# Altium schematic sheet 33_USB_VoCore.SchDoc
size A; SheetNumber: 7; SheetTotal: 11
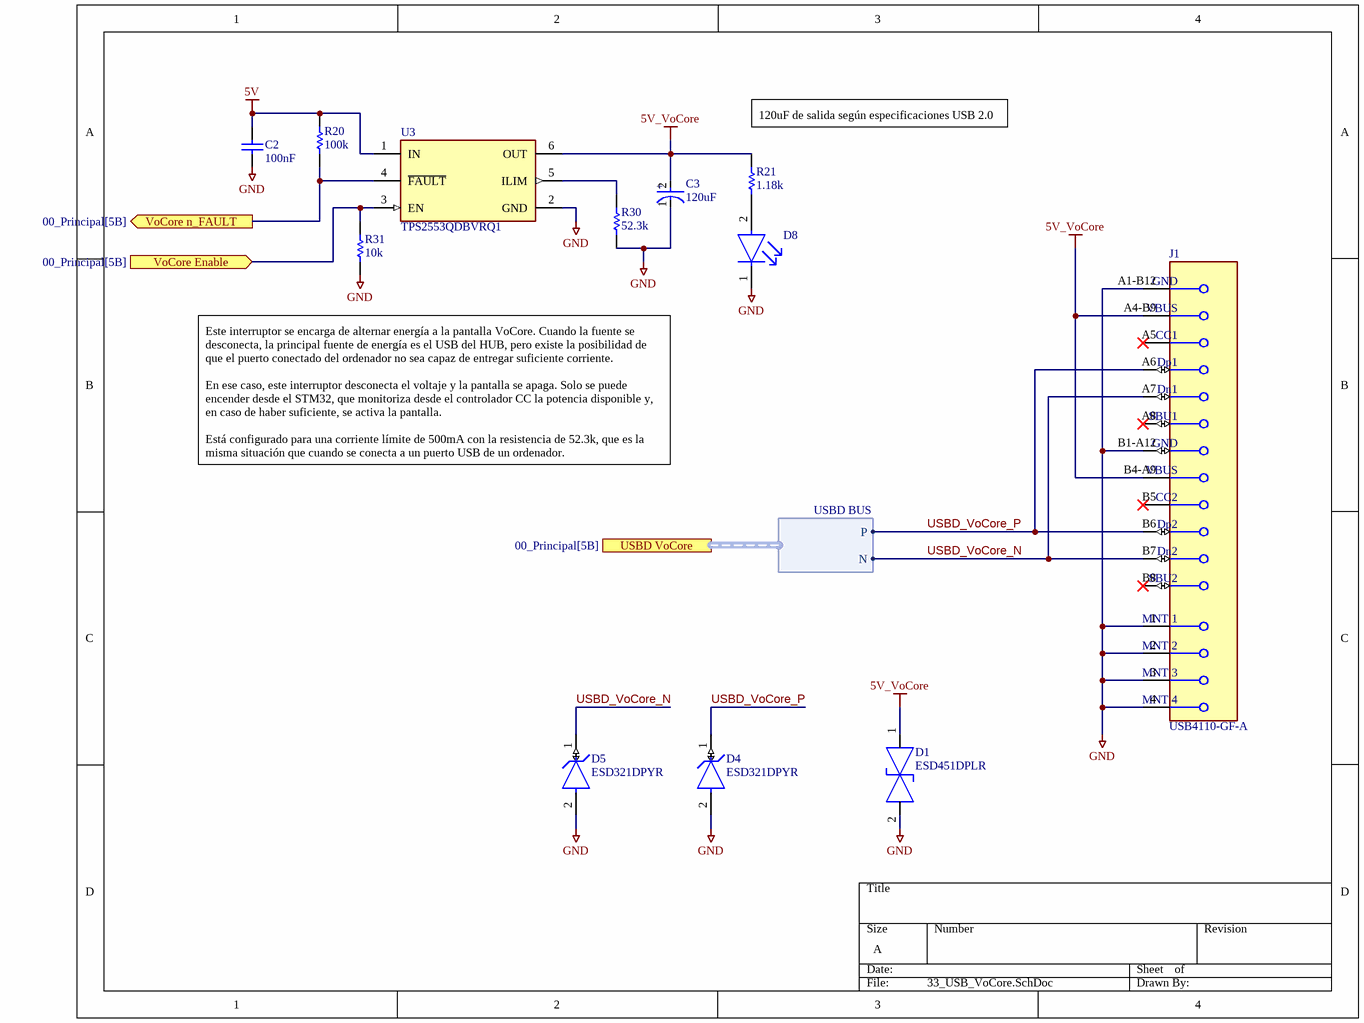
[diagram p0: 33_USB_VoCore.SchDoc]

## Parts
C2  100nF  [CAPC1005X55X25NL05T05]
C3  120uF  [FP-OS-CON-SMT-E7-MFG]
D1  ESD451DPLR  [FP-DPL0002A_MFG]
D4  ESD321DPYR  [FP-DPY0002A-MFG]
D5  ESD321DPYR  [FP-DPY0002A-MFG]
D8  APHD1608LZGCK  [FP-APHD1608LZGCK-MFG]  (value not drawn)
J1  USB4110-GF-A  [FP-USB4110-GF-A-MFG]
R20  100k  [RESC1005X40X25LL05T05]
R21  1.18k  [RESC1005X40X25NL05T05]
R30  52.3k  [RESC1005X40X25LL05T05]
R31  10k  [RESC1005X40X25ML05T05]
U3  TPS2553QDBVRQ1  [FP-DBV0006A-IPC_A]

## Ports
USBD VoCore (harness USBD BUS, see 00_Principal[5B]), VoCore Enable (in, see 00_Principal[5B]), VoCore n_FAULT (out, see 00_Principal[5B])

## Harnesses
USBD BUS: P, N

## Nets
5V: C2.2 R20.2 U3.1(IN)
5V_VoCore: C3.2(A) D1.1(1_IO) J1.A4-B9(VBUS) J1.B4-A9(VBUS) R21.2 U3.6(OUT)
GND: C2.1 C3.1(C) D1.2(2_IO) D4.2(GND) D5.2(GND) D8.1(C) J1.1(MNT_1) J1.2(MNT_2) J1.3(MNT_3) J1.4(MNT_4) J1.A1-B12(GND) J1.B1-A12(GND) R30.1 R31.1 U3.2(GND)
USBD_VoCore_N: D5.1(IO) J1.A7(Dn1) J1.B7(Dn2) ; port USBD VoCore.N
USBD_VoCore_P: D4.1(IO) J1.A6(Dp1) J1.B6(Dp2) ; port USBD VoCore.P
VoCore Enable: R31.2 U3.3(EN) ; port VoCore Enable
VoCore n_FAULT: R20.1 U3.4(~{FAULT}) ; port VoCore n_FAULT
NetD8_2: D8.2(A) R21.1
NetR30_2: R30.2 U3.5(ILIM)

Not connected (* = marked no-connect by the designer): J1 A5(CC1)* A8(SBU1)* B5(CC2)* B8(SBU2)*

## Notes on the sheet
- (near R21) 120uF de salida según especificaciones USB 2.0
- Este interruptor se encarga de alternar energía a la pantalla VoCore. Cuando la fuente se desconecta, la principal fuente de energía es el USB del HUB, pero existe la posibilidad de que el puerto conectado del ordenador no sea capaz de entregar suficiente corriente.
  En ese caso, este interruptor desconecta el voltaje y la pantalla se apaga. Solo se puede encender desde el STM32, que monitoriza desde el controlador CC la potencia disponible y, en caso de haber suficiente, se activa la pantalla.
  Está configurado para una corriente límite de 500mA con la resistencia de 52.3k, que es la misma situación que cuando se conecta a un puerto USB de un ordenador.
- (in symbol CMP-05428-000660-1) +

## Library data of the parts
C2 = CMP-2008-02030-1: Manufacturer: Vitramon; Part Number: VJ0402Y104KXJCW1BC
C3 = CMP-05428-000660-1: Conductive Polymer Aluminum Solid Capacitors (OS-CON) 120uF ±20% 10V RADIAL SMT 8x6.9mm; Dissipation Factor: 12%; Polarity: Polar; ESR (Equivalent Series Resistance): 35mR; Ripple Current (AC): 2.56A; Leakage Current: 240uA; Life (Hours): 2000Hour; RoHS Compliant: Yes; Height - Seated (Max): 0.276inch; Tolerance: 20%; REACH SVHC: No SVHC; Series: OS-CON™, SVP; Case/Package: Radial; Package Quantity: 1000; Length: 6.9mm; Voltage: 10V; Max Operating Temperature: 105°C; Construction: Cylindrical; Height: 6.9mm; Material: Polymer; Ripple Current: 2.56A; Diameter: 8mm; Number of Pins: 7; Termination: SMD/SMT; Lead Free: Lead Free; Voltage Rating: 10V; Packaging: Tape and Reel; Min Operating Temperature: -55°C; Capacitance: 120uF; Mount: Surface Mount; Voltage Rating (DC): 10V
D1 = CMP-00370-140306676-1: 0.5-pF, 5.5-V, 30-KV bidirectional ESD protection device in 0201 package 2-X2SON -40 to 125; Manufacturer Lifecycle Status: ACTIVE; Thickness: 300µm; ComponentLink3URL: https://www.ti.com/lit/ds/symlink/tpd1e04u04.pdf?ts=1701165483995&ref_url=https%253A%252F%252Fwww.ti.com%252Fproduct%252FTPD1E04U04%252Fpart-details%252FTPD1E04U04DPLR; ComponentLink3Description: Manufacturer's Package Drawing; Lifecycle Status: Production; ComponentLink1URL: http://ti.com; ComponentLink2Description: HelpURL; Width: 300µm; ComponentLink2URL: https://www.ti.com/lit/ds/symlink/esd451.pdf; Height: 320µm; Number of Pins: 2; ComponentLink1Description: Manufacturer's Website; Length: 600µm
D4 D5 = CMP-04989-000001-1: HDMI2.0 ESD PROTECTION; Manufacturer: Texas Instruments; Standoff Height: 0mm; Peak Pulse Current: 6A; Value: 0.9pF; Number Of Channels: 1; Reverse Standoff Voltage: 3.6V; Peak Pulse Power: 40W; Breakdown Voltage: 4.5V; Direction: Unidirectional; Clamping Voltage: 6.8V; RoHS: TRUE; Temperature: -40°C to +125°C; Package: DPY0002A; Temperature Range Low: -40°C; Temperature Range High: +125°C; Category: Diode; Capacitance: 0.9pF; Ambient Temperature Range Low: -40°C; Device Class L3: unset; Device Class L1: Circuit Protection; Ambient Temperature Range High: +125°C; ComponentLink2URL: http://www.ti.com/lit/ds/symlink/esd321.pdf; Octopart: https://octopart.com/esd321dpyr-texas+instruments-94354200; Manufacturer Part Number: ESD321DPYR; Digikey Description: HDMI2.0 ESD PROTECTION; Lead Free: Yes; ComponentLink2Description: Datasheet; Device Class L2: TVS Diodes; Height: 0.45mm; Automotive: No
D8 = CMP-44529-000045-1: LED GREEN CLEAR 1608 SMD; Test Current: 2mA; Dominant Wavelength: 525nm; Lens Color: Colorless; Luminous Intensity: 180mcd; Viewing Angle: 100°; Forward Voltage: 2.65V; Lens Size: 0.7mm; Lens Style: Round; Mount: Surface Mount; Packaging: Tape and Reel; Lens Transparency: Clear; Height: 0.75mm; Case/Package: 0603; Length: 1.6mm; Case Code (Metric): 1608; Width: 0.8mm; Color: Green; Case Code (Imperial): 0603
J1 = CMP-245163-000002-1: CONN USB 2.0 TYPE-C R/A SMT; Manufacturer: GCT; Conn Orientation: Right Angle; Usb Standard: USB 2.0; Voltage Rating: 20V; Current Rating: 3/4.25/1.25/0.25A; Number Of Contacts: 16; Is Female: yes; Shielding: true; Standoff Height: 0.1mm; Octopart: https://octopart.com/usb4110-gf-a-gct-103941985; Temperature: -40°C to +85°C; RoHS: TRUE; Automotive: No; Contact Material: Gold,Nickel; Device Class L1: Connectors; Device Class L2: USB Connectors; Package: 0; Lead Free: Yes; ComponentLink2URL: https://gct.co/files/drawings/usb4110.pdf; Temperature Range High: +85°C; Temperature Range Low: -40°C; Height: 3.46mm; Manufacturer Part Number: USB4110-GF-A; ComponentLink2Description: Datasheet; Device Class L3: unset; Digikey Description: CONN USB 2.0 TYPE-C R/A SMT; Category: Conn
R20 = CMP-2002-00602-1: Manufacturer: Panasonic; Part Number: ERJ-2RHD1003X
R21 = CMP-1011-00517-2: Part Number: ERJ-2RKF1181X; Manufacturer: Panasonic
R30 = CMP-2002-00981-1: Part Number: ERJ-2RKF5232X; Manufacturer: Panasonic
R31 = CMP-2002-00601-1: Manufacturer: Panasonic; Part Number: ERJ-2RHD1002X
U3 = CMP-04913-000016-1: IC PWR SWITCH N-CHAN 1:1 SOT23-6; Number of Outputs: 1; Output Current: 1.5A; Operating Supply Voltage: 6.5V; Turn-On Delay Time: 3ms; Min Input Voltage: 2.5V; Fault Protection: Over Temperature; Output Configuration: High Side; Interface: On/Off; Packaging: Tape and Reel; Lead Free: Lead Free; Min Operating Temperature: -40°C; Number of Pins: 6; Max Supply Current: 1.5A; Mount: Surface Mount; Max Input Voltage: 6.5V; Turn-Off Delay Time: 3ms; RoHS Compliant: Yes; Number of Switches: 1; Max Operating Temperature: 125°C; Package Quantity: 3000; Max Output Current: 1.5A; Series: -; Case/Package: SOT-23-6